# Altium schematic sheet Fuentes.SchDoc
size A4
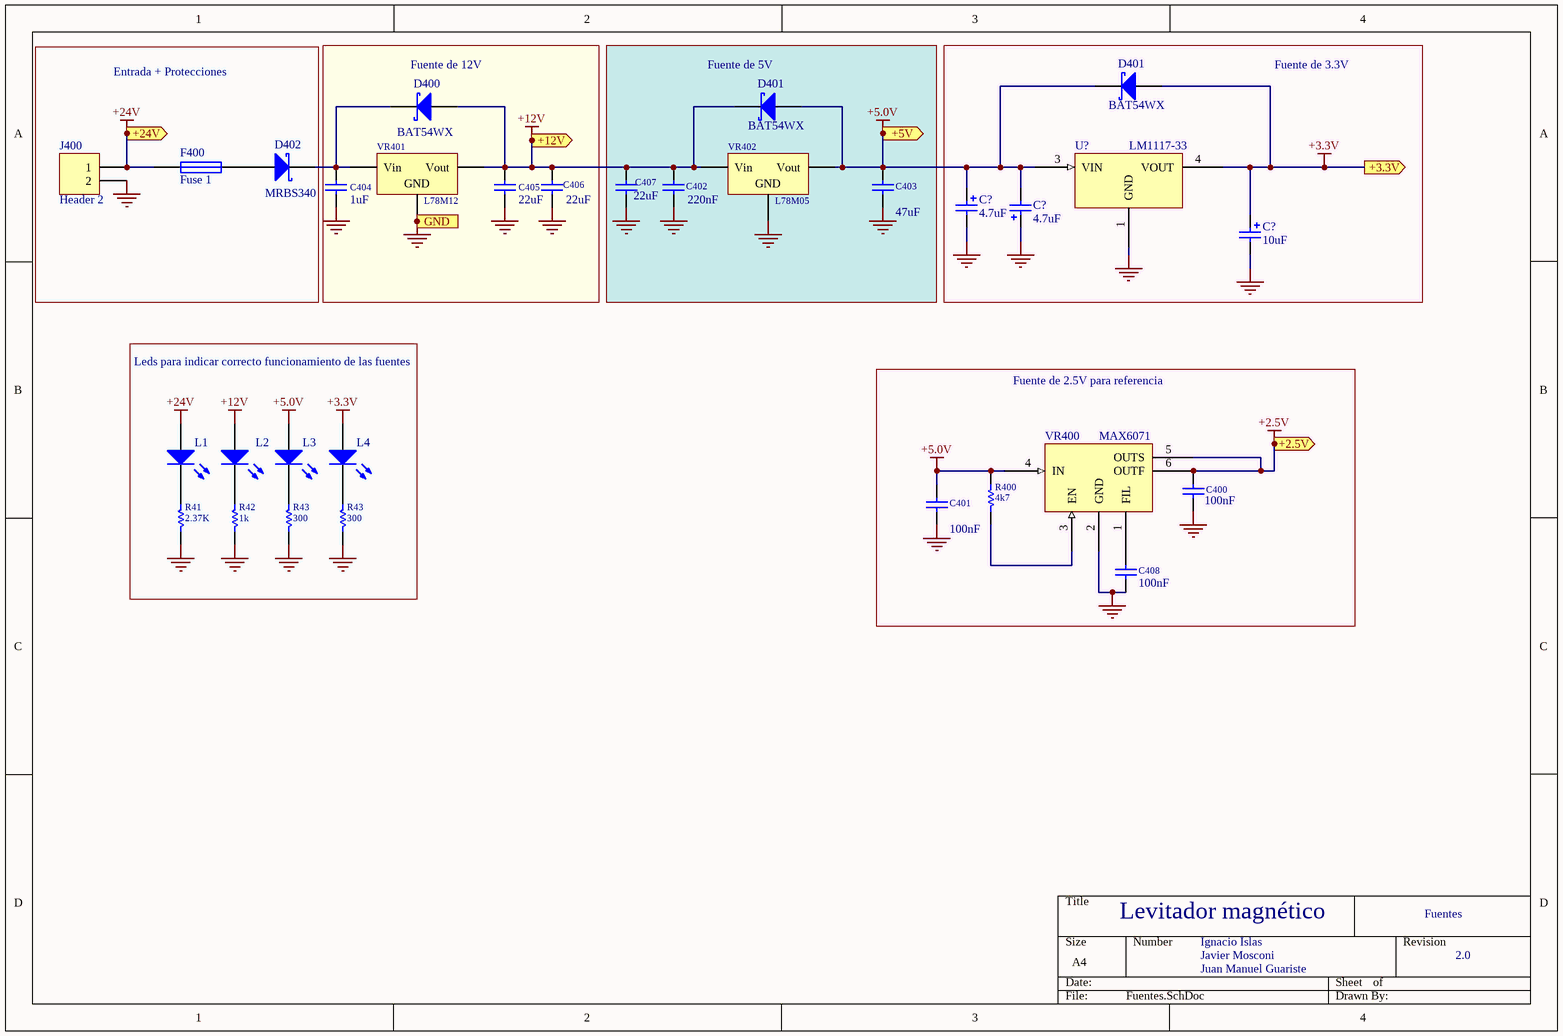
[diagram p0: Fuentes.SchDoc]

## Parts
(Parts that share a designator on the sheet are numbered #1, #2 ... from top to bottom, then left to right.)
C400  100nF  [C1206]
C401  100nF  [C1206]
C402  220nF  [C1206]
C403  47uF  [C1206]
C404  1uF  [C1206]
C405  22uF  [C1206]
C406  22uF  [C1206]
C407  22uF  [C1206]
C408  100nF  [C1206]
C?#1  value 4.7uF  [0805C2]  (hidden comment: Cap Pol2)
C?#2  value 4.7uF  [0805C2]  (hidden comment: Cap Pol2)
C?#3  value 10uF  [0805C2]  (hidden comment: Cap Pol2)
D400  BAT54WX  [SOD523]
D401#1  BAT54WX  [SOD523]
D401#2  BAT54WX  [SOD523]
D402  MRBS340  [DO214AB]
F400  Fuse 1  [R1206]
J400  Header 2  [SMKDS5-2-9.5]
L1  LED1  [LED 1206 RED]  (value not drawn)
L2  LED1  [LED 1206 RED]  (value not drawn)
L3  LED1  [LED 1206 RED]  (value not drawn)
L4  LED1  [LED 1206 RED]  (value not drawn)
R41  2.37K  [R 1206L]
R42  1k  [R 1206L]
R43#1  300  [R 1206L]
R43#2  300  [R 1206L]
R400  4k7  [R 1206L]
U?  LM1117-33  [SOT223-4M]
VR400  MAX6071  [SOT23-6]
VR401  L78M12  [TO252-AA]
VR402  L78M05  [TO252-AA]

## Blocks framed on the sheet
Entrada + Protecciones: D402 F400 J400
Fuente de 12V: C404-C406 D400 VR401
Fuente de 5V: C402 C403 C407 D401#2 VR402
Fuente de 3.3V: C?#1-C?#3 D401#1 U?
Leds para indicar correcto funcionamiento de las fuentes: L1-L4 R41 R42 R43#1 R43#2
Fuente de 2.5V para referencia: C400 C401 C408 R400 VR400

## Ports
+2.5V (out), +3.3V (out), +5V (out), +12V (out), +24V (out), GND

## Nets
+2.5V: C400.2 VR400.5(OUTS) VR400.6(OUTF) ; port +2.5V
+3.3V: C?#3.1 D401#1.1(A) L4.1(A) U?.4(VOUT) ; port +3.3V
+5.0V: C401.2 C403.2 C?#1.1 C?#2.2 D401#1.2(K) D401#2.1(A) L3.1(A) R400.2 U?.3(VIN) VR400.4(IN) VR402.3(Vout) ; port +5V
+12V: C402.2 C405.2 C406.2 C407.2 D400.1(A) D401#2.2(K) L2.1(A) VR401.3(Vout) VR402.1(Vin) ; port +12V
+24V: F400.1 J400.1 L1.1(A) ; port +24V
GND: C400.1 C401.1 C402.1 C403.1 C404.1 C405.1 C406.1 C407.1 C408.1 C?#1.2 C?#2.1 C?#3.2 J400.2 R41.1 R42.2 R43#1.1 R43#2.1 U?.1(GND) VR400.2(GND) VR401.4(GND) VR402.4(GND) ; port GND
NetC404_2: C404.2 D400.2(K) D402.2(K) VR401.1(Vin)
NetC408_2: C408.2 VR400.1(FIL)
NetD402_1: D402.1(A) F400.2
NetL1_2: L1.2(K) R41.2
NetL2_2: L2.2(K) R42.1
NetL3_2: L3.2(K) R43#1.2
NetL4_2: L4.2(K) R43#2.2
NetR400_1: R400.1 VR400.3(EN)

## Notes on the sheet
- Levitador magnético
- Fuentes
- Ignacio Islas
- Javier Mosconi
- Juan Manuel Guariste
- 2.0

## Library data of the parts
C400 C401 C408 = C1206: Capacitor Chip 1206; Dielectric: NP0; Voltage: 50V; Published: 8-Jun-2000; LatestRevisionDate: 26/08/2013; LatestRevisionNote: IPC-7351 Footprint Added.; PackageReference: 1206; Publisher: Altium Limited; PackageDescription: Chip Capacitor; Supplier 1: Digi-Key; Value: 100nF
C402 C404 = C1206: Capacitor Chip 1206; Dielectric: NP0; Voltage: 35V; Published: 8-Jun-2000; LatestRevisionDate: 26/08/2013; LatestRevisionNote: IPC-7351 Footprint Added.; PackageReference: 1206; Publisher: Altium Limited; PackageDescription: Chip Capacitor; Supplier 1: Digi-Key
  C402: Value: 220nF
  C404: Value: 1uF
C403 = C1206: Capacitor Chip 1206; Dielectric: NP0; Voltage: 6.3V; Published: 8-Jun-2000; LatestRevisionDate: 26/08/2013; LatestRevisionNote: IPC-7351 Footprint Added.; PackageReference: 1206; Publisher: Altium Limited; PackageDescription: Chip Capacitor; Supplier 1: Digi-Key; Value: 47uF
C405-C407 = C1206: Capacitor Chip 1206; Dielectric: NP0; Voltage: 16V; Published: 8-Jun-2000; LatestRevisionDate: 26/08/2013; LatestRevisionNote: IPC-7351 Footprint Added.; PackageReference: 1206; Publisher: Altium Limited; PackageDescription: Chip Capacitor; Supplier 1: Digi-Key; Value: 22uF
C?#1-C?#3 = Cap Pol2: Polarized Capacitor (Axial); P/N: Generic; Published: 8-Jun-2000; LatestRevisionDate: 17-Jul-2002; LatestRevisionNote: Re-released for DXP Platform.; PackageReference: POLAR0.8; Publisher: Altium Limited; Package: 0603
D400 D401#1 D401#2 D402 = Diode 10TQ035: Schottky Rectifier; Note: Terminal 2 is the TAB and is electrically connected to the cathode; Published: 8-Jun-2000; LatestRevisionDate: 17-Jul-2002; LatestRevisionNote: Re-released for DXP Platform.; DatasheetDocument: PD-2.057B; PackageDocument: Feb-1998; PackageReference: TO-220AC; Publisher: Altium Limited; ComponentLink1Description: Manufacturer Link; ComponentLink1URL: http://www.irf.com/; ComponentLink2Description: Datasheet; ComponentLink2URL: http://www.irf.com/product-info/datasheets/data/10tq.pdf
F400 = Fuse 1: Fuse; Published: 8-Jun-2000; LatestRevisionDate: 17-Jul-2002; LatestRevisionNote: Re-released for DXP Platform.; PackageReference: PIN-W2/E2.8; Publisher: Altium Limited
J400 = Header 2: Header, 2-Pin; LatestRevisionDate: 17-Jul-2002; LatestRevisionNote: Re-released for DXP Platform.; Publisher: Altium Limited
L1-L4 = LED1: Typical RED GaAs LED; Published: 8-Jun-2000; LatestRevisionDate: 08-Jul-2005; LatestRevisionNote: Mech Layer 1 removed.; PackageReference: LED-1; Publisher: Altium Limited
R41 R42 R43#1 R43#2 R400 = R1206: Resistor Chip; 1/8W;; Published: 8-Jun-2000; LatestRevisionDate: 26/8/2013; PackageReference: 1206; Publisher: Altium Limited; PackageDescription: SMT Chip Resistor; Supplier 1: Digi-Key
  R41: Value: 2.37K
  R42: Value: 1k
  R43#1 R43#2: Value: 300
  R400: Value: 4k7
U? = LM1117-XX: Value: LM1117-33
VR400 = MAX6070
VR401 VR402 = Volt Reg: Voltage Regulator; Published: 24-Mar-1999; LatestRevisionDate: 17-Jul-2002; LatestRevisionNote: Re-released for DXP Platform.; PackageReference: D2PAK; Publisher: Altium Limited; Code_JEDEC: SMD-220